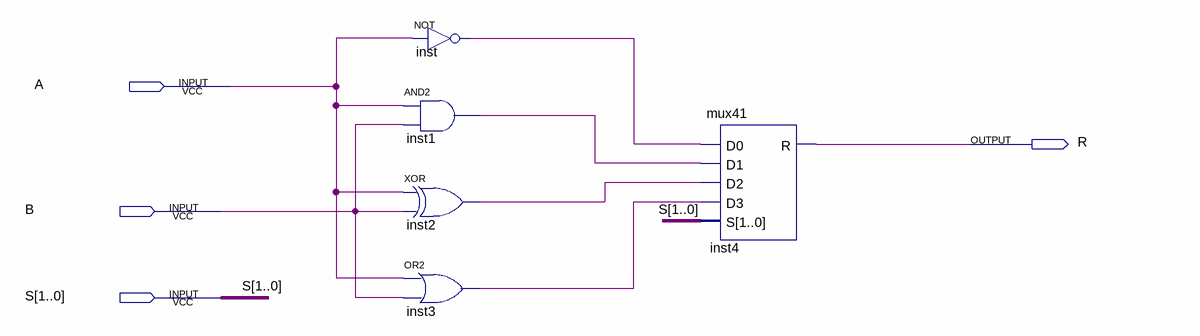
[diagram p0: schematic sheet]
// Quartus schematic LU.bdf as structural Verilog: 5 symbols, 4 pins
module LU (
  input  A,
  input  B,
  input  [1:0] S,
  output R
);

  wire inst1_out, inst2_out, inst3_out, inst_out;

  not inst (inst_out, A);
  and inst1 (inst1_out, A, B);
  xor inst2 (inst2_out, A, B);
  or inst3 (inst3_out, A, B);
  mux41 inst4 (.D0(inst_out), .D1(inst1_out), .D2(inst2_out), .D3(inst3_out), .S(S), .R(R));
endmodule
